# EAGLE design temperature-sensor (EAGLE 5.00)
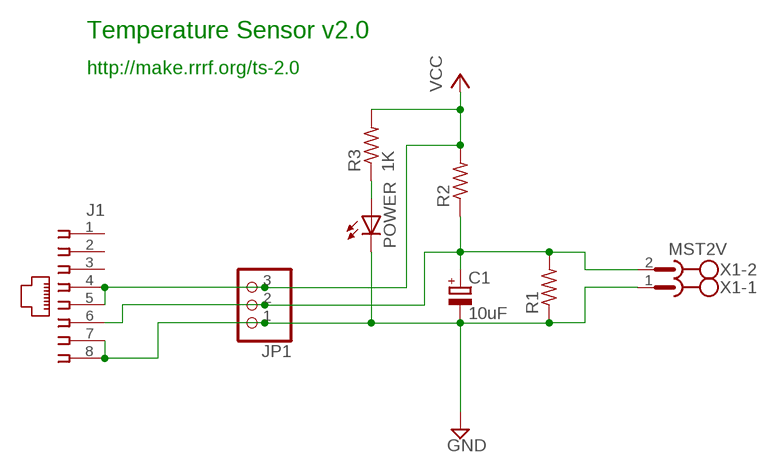
[diagram p0: schematic, sheet 1]

## Parts
C1  10uF  CPOL-EUE2-5  [E2-5]
J1  520426-4  [520426-4]
JP1  PINHD-1X3  [1X03]
POWER  LED3MM  [LED3MM]
R1  R-US_0207/7  [0207/7]
R2  R-US_0207/7  [0207/7]
R3  1K  R-US_0207/7  [0207/7]
X1  MST2V  [MSTBV2]

## Nets
GND: C1.- J1.7 J1.8 JP1.1 POWER.K(C) R1.1 X1.1
N$1: POWER.A R3.1
N$2: C1.+ J1.6 JP1.2 R1.2 R2.1 X1.2
VCC: J1.4 J1.5 JP1.3 R2.2 R3.2
Unconnected: J1.1 J1.2 J1.3

## Notes on the sheet
- Temperature Sensor v2.0
- http://make.rrrf.org/ts-2.0

## Library data of the parts
C1 = rcl:CPOL-EU: POLARIZED CAPACITOR, European symbol
J1 = con-amp:520426-4: AMP connector
JP1 = pinhead:PINHD-1X3: PIN HEADER
POWER = led:LED: LED OSRAM: - CHIPLED LG R971, LG N971, LY N971, LG Q971, LY Q971, LO R971, LY R971 LH N974, LH R974 LS Q976, LO Q976, LY Q976 LO Q996 - Hyper CHIPLED LW Q18S LB Q993, LB Q99A, LB R99A - SideLED LS A670, LO A670, LY A670, LG A670, LP A670 LB A673, LV A673, LT A673, LW A673 LH A674 LY A675 LS A676, LA A676, LO A676, LY A676, LW A676 LS A679, LY A679, LG A679 - Hyper Micro SIDELED® LS Y876, LA Y876, LO Y876, LY Y876 LT Y87S - SmartLED LW L88C, LW L88S LB L89C, LB L89S, LG L890 LS L89K, LO L89K, LY L89K LS L896, LA L896, LO L896, LY L896 - TOPLED LS T670, LO T670, LY T670, LG T670, LP T670 LSG T670, LSP T670, LSY T670, LOP T670, LYG T670 LG T671, LOG T671, LSG T671 LB T673, LV T673, LT T673, LW T673 LH T674 LS T676, LA T676, LO T676, LY T676, LB T676, LH T676, LSB T676, LW T676 LB T67C, LV T67C, LT T67C, LS T67K, LO T67K, LY T67K, LW E67C LS E67B, LA E67B, LO E67B, LY E67B, LB E67C, LV E67C, LT E67C LW T67C LS T679, LY T679, LG T679 LS T770, LO T770, LY T770, LG T770, LP T770 LB T773, LV T773, LT T773, LW T773 LH T774 LS E675, LA E675, LY E675, LS T675 LS T776, LA T776, LO T776, LY T776, LB T776 LHGB T686 LT T68C, LB T68C - Hyper Mini TOPLED® LB M676 - Mini TOPLED Santana® LG M470 LS M47K, LO M47K, LY M47K Source: http://www.osram.convergy.de - LUMILED® LXK2-PW12-R00, LXK2-PW12-S00, LXK2-PW14-U00, LXK2-PW14-V00 LXK2-PM12-R00, LXK2-PM12-S00, LXK2-PM14-U00 LXK2-PE12-Q00, LXK2-PE12-R00, LXK2-PE12-S00, LXK2-PE14-T00, LXK2-PE14-U00 LXK2-PB12-K00, LXK2-PB12-L00, LXK2-PB12-M00, LXK2-PB14-N00, LXK2-PB14-P00, LXK2-PB14-Q00 LXK2-PR12-L00, LXK2-PR12-M00, LXK2-PR14-Q00, LXK2-PR14-R00 LXK2-PD12-Q00, LXK2-PD12-R00, LXK2-PD12-S00 LXK2-PH12-R00, LXK2-PH12-S00 LXK2-PL12-P00, LXK2-PL12-Q00, LXK2-PL12-R00 Source: www.luxeon.com
R1 R2 = rcl:R-US_: RESISTOR, American symbol
R3 = resistor:R-US_: RESISTOR, American symbol
X1 = con-phoenix-508:MST2V: PHOENIX

## Net classes
0 default: width 0.406 mm, clearance 0.406 mm

## Board
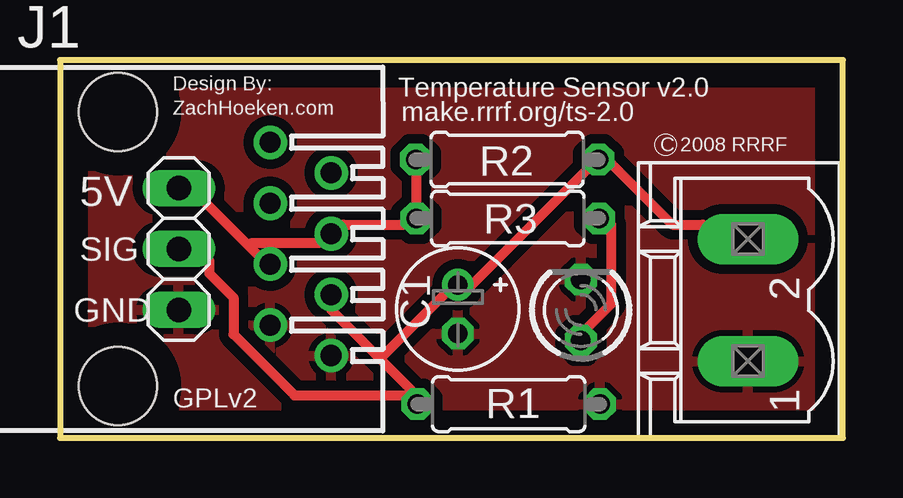
[diagram p1: board, top side]
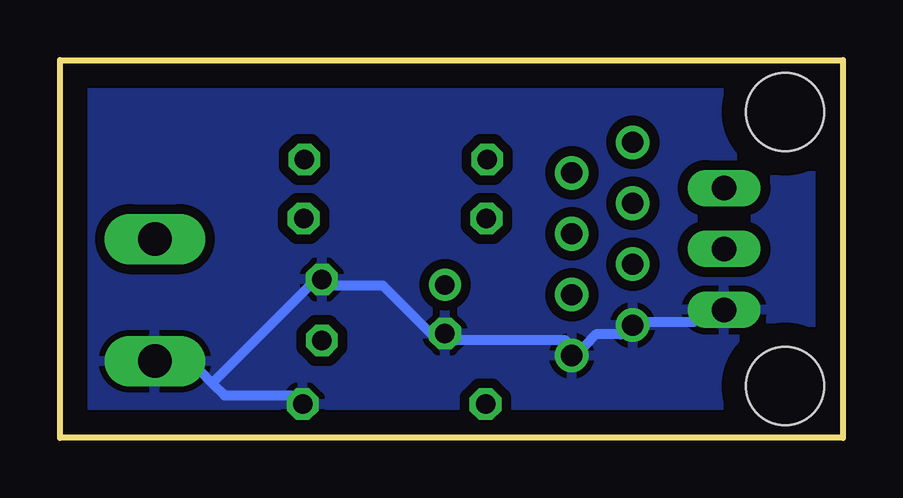
[diagram p2: board, bottom side, seen from below]

Size 32.64 x 15.75 mm. Coordinates in mm from the lower left corner, seen from the top.
Outline: 32.64,15.75 0,15.75 0,0 32.64,0 32.64,15.75
Copper layers (1*16): Top 0.035mm / dielectric 1.5mm / Bottom 0.035mm
Design rules "default": minimum track width 10mil, minimum drill 24mil, track to track 8mil, track to pad 8mil, pad to pad 8mil, via to via 8mil, smd to smd 8mil, copper to edge 40mil, drill to drill 8mil, minimum pad ring 10mil, minimum via ring 8mil, stop-mask expansion 4mil, vias tented up to drill 0mil, thermal gap 10mil

### Footprints (pad centres in the part's own frame; a part is rotated, then mirrored left to right if it is on the bottom)
E2-5 = drill 0.813 pad 1.27 round: + -1.016,0 | drill 0.813 pad 1.27 octagon: - 1.016,0
520426-4 = drill 0.889 round: 1 -4.445,6.35; 2 -3.175,8.89; 3 -1.905,6.35; 4 -0.635,8.89; 5 0.635,6.35; 6 1.905,8.89; 7 3.175,6.35; 8 4.445,8.89 | hole 3.251: -5.715,0; 5.715,0
1X03 = drill 1.016 long: 1 -2.54,0; 2 0,0; 3 2.54,0
LED3MM = drill 0.813 octagon: A -1.27,0; K 1.27,0
0207/7 = drill 0.813 octagon: 1 -3.81,0; 2 3.81,0
MSTBV2 = drill 1.397 long: 1 -2.54,0; 2 2.54,0

### Placement (x,y rotation side)
C1  16.59,5.37 270 top
J1  2.41,7.87 270 top
JP1  4.95,7.87 90 top
POWER  21.72,5.33 90 top
R1  18.71,1.41 180 top
R2  18.64,11.6 180 top
R3  18.67,9.14 180 top
X1  28.68,5.75 90 top

### Tracks (layer width: path | path; a pad name or v marks a point on that pad's centre or on a via)
GND
  Bottom 0.406: 26.29,2.29 26.8,2.79 X1.1 | 26.29,2.29 25.78,1.78 22.99,1.78 R1.1 | 26.29,2.29 22.23,6.35 POWER.K 21.21,6.35 19.18,6.35 17.15,4.32 C1.- 16.13,4.06 11.56,4.06 J1.8 10.79,3.81 10.29,4.32 9.27,4.32 J1.7 8.25,4.83 6.22,4.83 JP1.1
  pour Bottom: -0.38,16.26 33.15,16.26 33.15,-0.51 -0.38,-0.51
  pour Top: -0.38,16.26 33.15,16.26 33.15,-0.51 -0.38,-0.51
N$1
  Top 0.406: POWER.A 21.97,4.57 22.99,5.59 22.99,8.89 R3.1
N$2
  Top 0.406: 13.33,3.3 11.3,5.33 J1.6 | 13.33,3.3 14.6,2.03 R1.2 14.35,1.78 9.78,1.78 7.24,4.32 7.24,5.84 6.22,6.86 6.22,7.37 JP1.2 | 13.33,3.3 16.13,6.1 C1.+ 17.15,6.35 21.97,11.18 R2.1 22.99,11.43 25.53,8.89 26.8,8.89 X1.2
VCC
  Top 0.406: R2.2 14.86,11.18 R3.2 14.35,8.89 11.81,8.89 J1.4 10.79,8.13 8,8.13 7.87,8 | 7.87,8 5.97,9.91 JP1.3 | 7.87,8 8.25,7.62 J1.5

### Text on the board
tPlace: Design By: | Temperature Sensor v2.0 | ZachHoeken.com | make.rrrf.org/ts-2.0 | C 2008 RRRF | 5V | SIG | GND | GPLv2